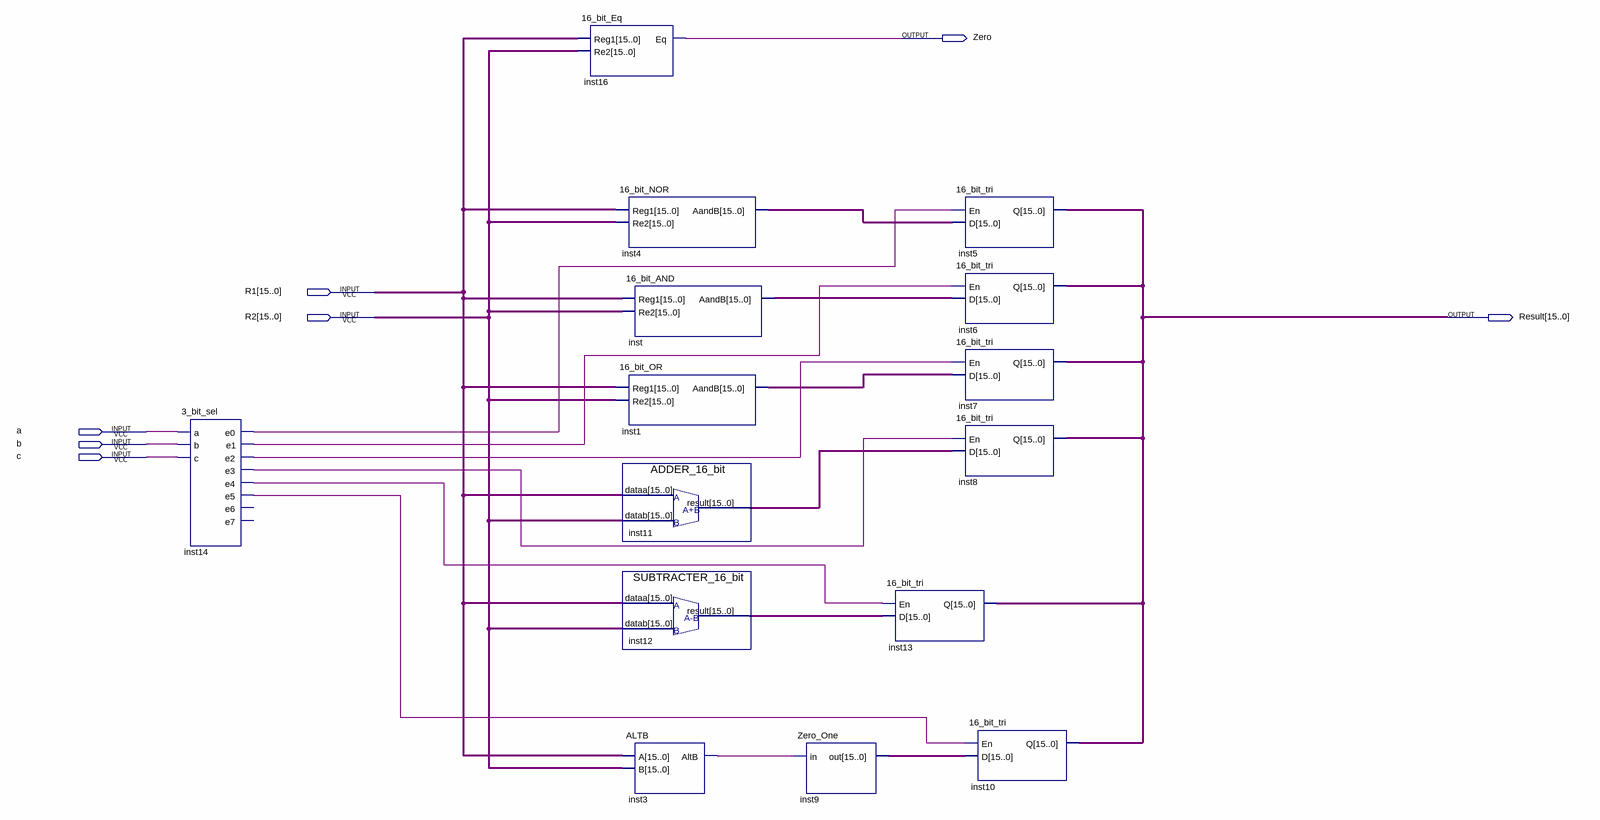
[diagram p0: schematic sheet]
// Quartus schematic ALU.bdf as structural Verilog: 15 symbols, 7 pins
module ALU (
  input  [15:0] R1,
  input  [15:0] R2,
  input  a,
  input  b,
  input  c,
  output Zero,
  output [15:0] Result
);

  wire inst3_altb, inst14_e0, inst14_e1, inst14_e2, inst14_e3, inst14_e4, inst14_e5;
  wire [15:0] inst1_aandb, inst4_aandb, inst9_out, inst11_result, inst12_result, inst_aandb;

  \3_bit_sel  inst14 (
    .a(a), .b(b), .c(c), .e0(inst14_e0), .e1(inst14_e1), .e2(inst14_e2), .e3(inst14_e3), .e4(inst14_e4),
    .e5(inst14_e5));  // open: e6, e7
  \16_bit_Eq  inst16 (.Reg1(R1), .Re2(R2), .Eq(Zero));
  \16_bit_NOR  inst4 (.Reg1(R1), .Re2(R2), .AandB(inst4_aandb));
  \16_bit_AND  inst (.Reg1(R1), .Re2(R2), .AandB(inst_aandb));
  \16_bit_OR  inst1 (.Reg1(R1), .Re2(R2), .AandB(inst1_aandb));
  ADDER_16_bit inst11 (.dataa(R1), .datab(R2), .result(inst11_result));
  SUBTRACTER_16_bit inst12 (.dataa(R1), .datab(R2), .result(inst12_result));
  ALTB inst3 (.A(R1), .B(R2), .AltB(inst3_altb));
  Zero_One inst9 (.in(inst3_altb), .out(inst9_out));
  \16_bit_tri  inst13 (.En(inst14_e4), .D(inst12_result), .Q(Result));
  \16_bit_tri  inst5 (.En(inst14_e0), .D(inst4_aandb), .Q(Result));
  \16_bit_tri  inst6 (.En(inst14_e1), .D(inst_aandb), .Q(Result));
  \16_bit_tri  inst7 (.En(inst14_e2), .D(inst1_aandb), .Q(Result));
  \16_bit_tri  inst8 (.En(inst14_e3), .D(inst11_result), .Q(Result));
  \16_bit_tri  inst10 (.En(inst14_e5), .D(inst9_out), .Q(Result));
endmodule
